# Altium project Project_2.PrjPcb
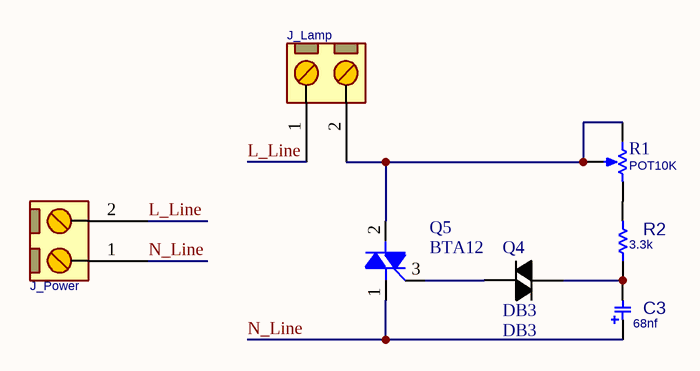
[diagram p0: Sheet1.SchDoc]
1 sheet, 7 parts. Net scope: global (net labels, ports and power ports of the same name join across sheets).
Board file: PCB1.PcbDoc

## Sheet Sheet1.SchDoc
size A; SheetNumber: 1; SheetTotal: 1

### Parts
C3  value 68nf  [C_FLM_7X5H11]
J_Lamp  CONN_TB2  [MSTB_2]  (value not drawn)
J_Power  CONN_TB2  [MSTB_2]  (value not drawn)
Q4  DB3  [D_AX03_DO35]
Q5  BTA12  [TO220_3]
R1  POT10K  [VOL_R]
R2  3.3k  [R025W_AX04]

### Nets
L_Line: J_Lamp.1 J_Power.2
N_Line: C3.1 J_Power.1 Q5.1(T1)
NetC3_2: C3.2 Q4.2(A2) R2.1
NetJ_Lamp_2: J_Lamp.2 Q5.2(T2) R1.1(TOP) R1.2(TAP)
NetQ4_1: Q4.1(A1) Q5.3(G)
NetR1_3: R1.3(BOT) R2.2

### Library data of the parts
C3 = CAP_THD_FLM: CAP, THD, FILM,; MANF_P#: MANF_PART#; PARAM2: 25V; DESC: DESCRIPTION; DIST#: MOUSER; PARAM: 20%; PRICE: 10= 5$; MANF: MANF; ASSEMBLY: ASSEMBLY
J_Lamp J_Power = CONN_MSTB_2: CONN, PHOENIX MSTB, 5-G, 5.08mm pitch; PARAM2: 320V; PARAM: 12A; VALUE: CONN_TB2
Q4 = DIAC_DB3_DO35: Diac, 32VBO, DO-35; MANF: ST; PARAM: 2A, -40~125oC; MANF_P#: DB3; PRICE: toman@PAYA; PARAM2: 32VBO; VALUE: DB3
Q5 = TRIAC_BTA12-600_TO220: Triac, 600V, 12A, TO-220; MANF_P#: BTA12-600BW, BTA12-600CW, BTA12-600TW; MANF: ST; PRICE: 1200toman@PAYA; VALUE: BTA12
R1 = RES_THD_POT_VOL: RESISTOR, THD, Potentiometer Volume; VALUE: POT10K
R2 = RES_THD: RESISTOR, THD; MANF_P#: RK73H1ETTP4701F; MANF: KOA SPEER; PARAM: 0.063W; DESC: DESCRIPTION; DIST#: MOUSER; PARAM2: 1%; ASSEMBLY: ASSEMBLY; PRICE: 100= 0.5$; VALUE: 3.3k